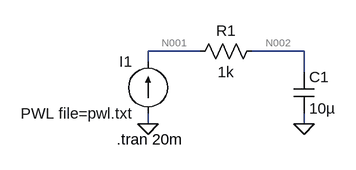
[diagram p0: schematic triangle_wave.asc]
triangle_wave.asc, the LTspice schematic file:
Version 4
SHEET 1 880 680
WIRE -32 128 -112 128
WIRE 128 128 48 128
WIRE -112 144 -112 128
WIRE 128 160 128 128
WIRE -112 240 -112 224
WIRE 128 240 128 224
FLAG 128 240 0
FLAG -112 240 0
SYMBOL cap 112 160 R0
SYMATTR InstName C1
SYMATTR Value 10µ
SYMBOL res 64 112 R90
WINDOW 0 0 56 VBottom 2
WINDOW 3 32 56 VTop 2
SYMATTR InstName R1
SYMATTR Value 1k
SYMBOL current -112 224 R180
WINDOW 0 24 80 Left 2
WINDOW 3 24 0 Left 2
WINDOW 123 0 0 Left 2
WINDOW 39 0 0 Left 2
SYMATTR InstName I1
SYMATTR Value PWL file=pwl.txt
TEXT -160 264 Left 2 !.tran 20m

The netlist it stands for:
* triangle_wave.asc
C1 N002 0 10µ
R1 N002 N001 1k
I1 0 N001 PWL file=pwl.txt
.tran 20m
.backanno
.end

* Results of the author's LTspice run, read from the files saved beside the schematic
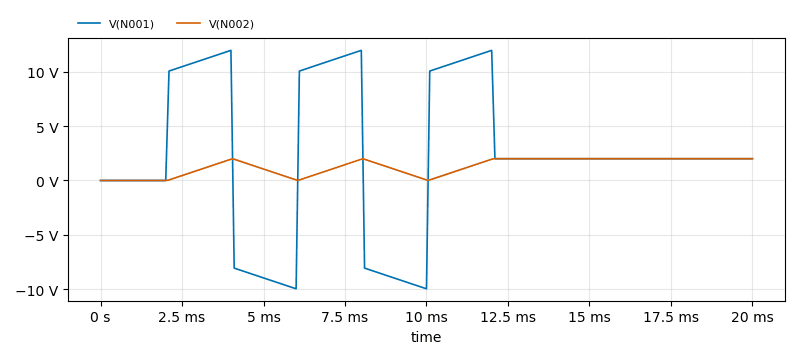
[diagram p1: Transient Analysis of triangle_wave.asc, plotted from the saved traces]
* Transient Analysis, 1 run:
*   V(N001): min -9.95 V, max 11.95 V, average 2.295 V, rms 7.292 V, last 2 V
*   V(N002): min 0 V, max 2 V, average 1.295 V, rms 1.57 V, last 2 V